# Altium schematic sheet STM32.SchDoc
size A3; SheetNumber: 3; SheetTotal: 7
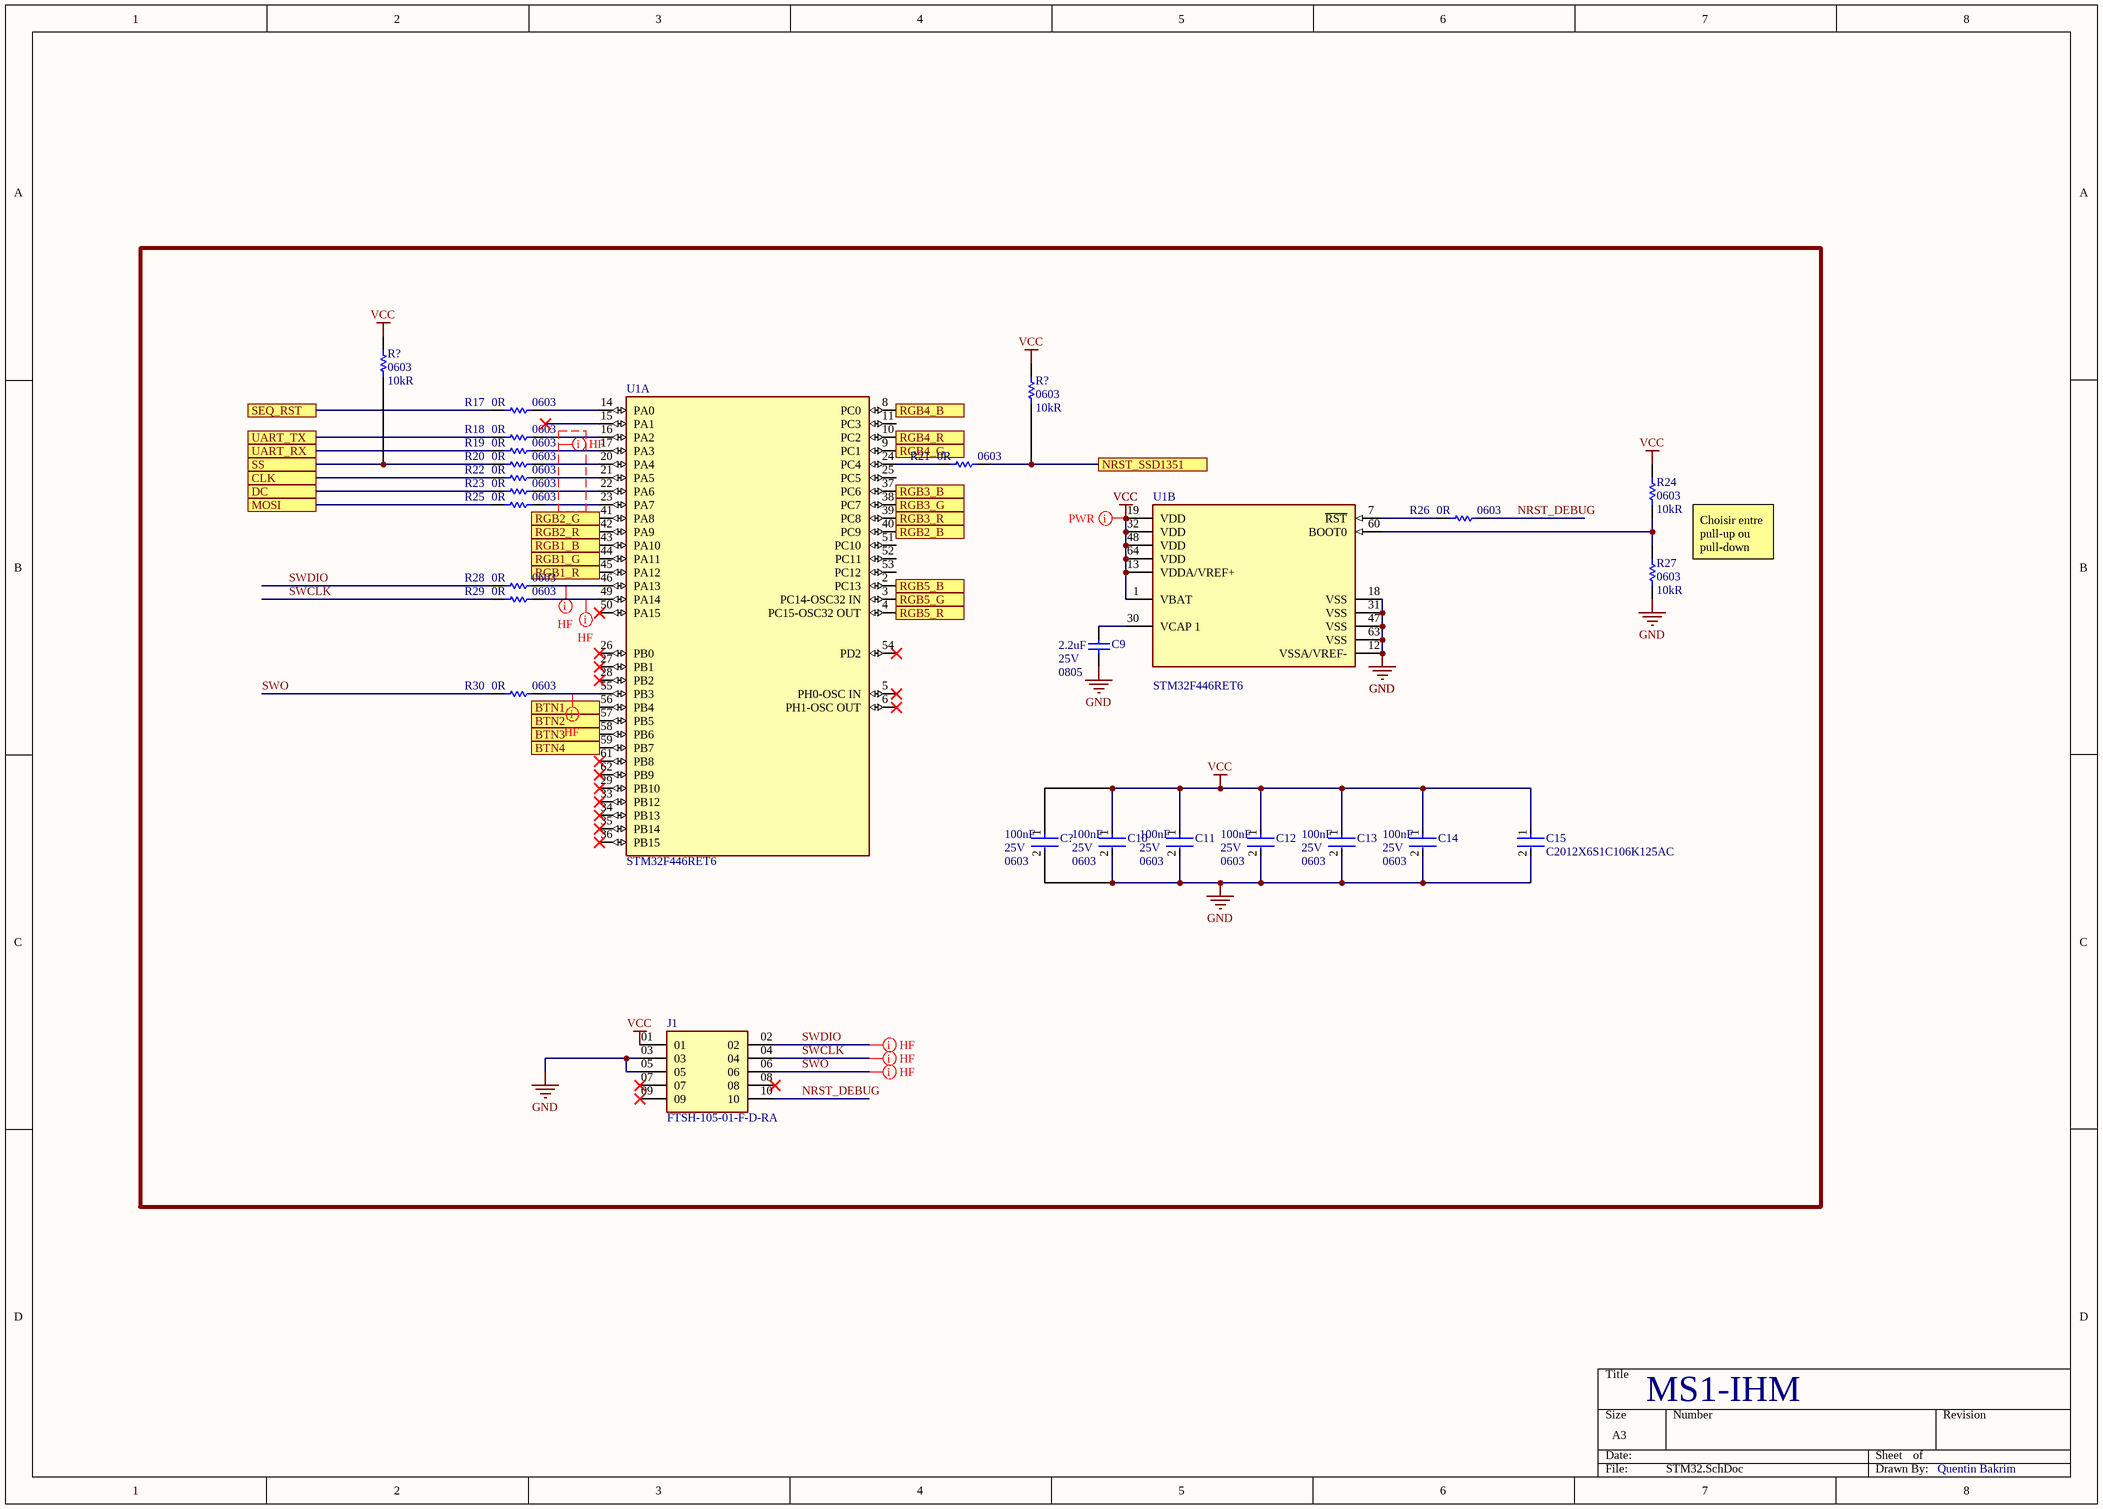
[diagram p0: STM32.SchDoc]

## Parts
(Parts that share a designator on the sheet are numbered #1, #2 ... from top to bottom, then left to right.)
C9  Case/Package: 0805  Capacitance: 2.2uF  Voltage Rating: 25V  [CAPC2013X140X45NL15T25]  (hidden comment: GRM21BR71E225KA73L)
C10  Case/Package: 0603  Voltage Rating (DC): 25V  Capacitance: 100nF  [FP-CGA3E-0_3-0_1-MFG]  (hidden comment: CGA3E2X7R1E104K080AA)
C11  Case/Package: 0603  Voltage Rating (DC): 25V  Capacitance: 100nF  [FP-CGA3E-0_3-0_1-MFG]  (hidden comment: CGA3E2X7R1E104K080AA)
C12  Case/Package: 0603  Voltage Rating (DC): 25V  Capacitance: 100nF  [FP-CGA3E-0_3-0_1-MFG]  (hidden comment: CGA3E2X7R1E104K080AA)
C13  Case/Package: 0603  Voltage Rating (DC): 25V  Capacitance: 100nF  [FP-CGA3E-0_3-0_1-MFG]  (hidden comment: CGA3E2X7R1E104K080AA)
C14  Case/Package: 0603  Voltage Rating (DC): 25V  Capacitance: 100nF  [FP-CGA3E-0_3-0_1-MFG]  (hidden comment: CGA3E2X7R1E104K080AA)
C15  C2012X6S1C106K125AC  [FP-C2012-125-0_2-MFG]
C?  Case/Package: 0603  Voltage Rating (DC): 25V  Capacitance: 100nF  [FP-CGA3E-0_3-0_1-MFG]  (hidden comment: CGA3E2X7R1E104K080AA)
J1  FTSH-105-01-F-D-RA  [SAMTEC_FTSH-105-01-F-D-RA]
R17  PackageReference: 0603  Resistor: 0R  [RESC1609X50X30NL8T20]  (hidden comment: CRCW06030000Z0EA)
R18  PackageReference: 0603  Resistor: 0R  [RESC1609X50X30NL8T20]  (hidden comment: CRCW06030000Z0EA)
R19  PackageReference: 0603  Resistor: 0R  [RESC1609X50X30NL8T20]  (hidden comment: CRCW06030000Z0EA)
R20  PackageReference: 0603  Resistor: 0R  [RESC1609X50X30NL8T20]  (hidden comment: CRCW06030000Z0EA)
R21  PackageReference: 0603  Resistor: 0R  [RESC1609X50X30NL8T20]  (hidden comment: CRCW06030000Z0EA)
R22  PackageReference: 0603  Resistor: 0R  [RESC1609X50X30NL8T20]  (hidden comment: CRCW06030000Z0EA)
R23  PackageReference: 0603  Resistor: 0R  [RESC1609X50X30NL8T20]  (hidden comment: CRCW06030000Z0EA)
R24  Case\/Package: 0603  Resistance: 10kR  [RESC1609X55X30LL15T15]  (hidden comment: ERJ3EKF1002V)
R25  PackageReference: 0603  Resistor: 0R  [RESC1609X50X30NL8T20]  (hidden comment: CRCW06030000Z0EA)
R26  PackageReference: 0603  Resistor: 0R  [RESC1609X50X30NL8T20]  (hidden comment: CRCW06030000Z0EA)
R27  Case\/Package: 0603  Resistance: 10kR  [RESC1609X55X30LL15T15]  (hidden comment: ERJ3EKF1002V)
R28  PackageReference: 0603  Resistor: 0R  [RESC1609X50X30NL8T20]  (hidden comment: CRCW06030000Z0EA)
R29  PackageReference: 0603  Resistor: 0R  [RESC1609X50X30NL8T20]  (hidden comment: CRCW06030000Z0EA)
R30  PackageReference: 0603  Resistor: 0R  [RESC1609X50X30NL8T20]  (hidden comment: CRCW06030000Z0EA)
R?#1  Case\/Package: 0603  Resistance: 10kR  [RESC1609X55X30LL15T15]  (hidden comment: ERJ3EKF1002V)
R?#2  Case\/Package: 0603  Resistance: 10kR  [RESC1609X55X30LL15T15]  (hidden comment: ERJ3EKF1002V)
U1  STM32F446RET6  [FP-LQFP64-5W-MFG]  (parts A,B of 2)

## Ports
BTN1, BTN2, BTN3, BTN4, CLK, DC, MOSI, NRST_SSD1351, RGB1_B, RGB1_G, RGB1_R, RGB2_B, RGB2_G, RGB2_R, RGB3_B, RGB3_G, RGB3_R, RGB4_B, RGB4_G, RGB4_R, RGB5_B, RGB5_G, RGB5_R, SEQ_RST, SS, UART_RX, UART_TX

## Nets
GND: C9.1 C10.2 C11.2 C12.2 C13.2 C14.2 C15.2 C?.2 J1.03 J1.05 R27.1 U1.12(VSSA/VREF-) U1.18(VSS) U1.31(VSS) U1.47(VSS) U1.63(VSS)
VCC: C10.1 C11.1 C12.1 C13.1 C14.1 C15.1 C?.1 J1.01 R24.2 R?#1.2 R?#2.2 U1.1(VBAT) U1.13(VDDA/VREF+) U1.19(VDD) U1.32(VDD) U1.48(VDD) U1.64(VDD)
BTN1: U1.56(PB4) ; port BTN1
BTN2: U1.57(PB5) ; port BTN2
BTN3: U1.58(PB6) ; port BTN3
BTN4: U1.59(PB7) ; port BTN4
CLK: R22.1 ; port CLK
DC: R23.1 ; port DC
MOSI: R25.1 ; port MOSI
NRST_DEBUG: J1.10 R26.2
NRST_SSD1351: R21.2 R?#2.1 ; port NRST_SSD1351
RGB1_B: U1.43(PA10) ; port RGB1_B
RGB1_G: U1.44(PA11) ; port RGB1_G
RGB1_R: U1.45(PA12) ; port RGB1_R
RGB2_B: U1.40(PC9) ; port RGB2_B
RGB2_G: U1.41(PA8) ; port RGB2_G
RGB2_R: U1.42(PA9) ; port RGB2_R
RGB3_B: U1.37(PC6) ; port RGB3_B
RGB3_G: U1.38(PC7) ; port RGB3_G
RGB3_R: U1.39(PC8) ; port RGB3_R
RGB4_B: U1.8(PC0) ; port RGB4_B
RGB4_G: U1.9(PC1) ; port RGB4_G
RGB4_R: U1.10(PC2) ; port RGB4_R
RGB5_B: U1.2(PC13) ; port RGB5_B
RGB5_G: U1.3(PC14-OSC32_IN) ; port RGB5_G
RGB5_R: U1.4(PC15-OSC32_OUT) ; port RGB5_R
SEQ_RST: R17.1 ; port SEQ_RST
SS: R20.1 R?#1.1 ; port SS
SWCLK: J1.04 R29.1
SWDIO: J1.02 R28.1
SWO: J1.06 R30.1
UART_RX: R19.1 ; port UART_RX
UART_TX: R18.1 ; port UART_TX
NetC9_2: C9.2 U1.30(VCAP_1)
NetR17_2: R17.2 U1.14(PA0)
NetR18_2: R18.2 U1.16(PA2)
NetR19_2: R19.2 U1.17(PA3)
NetR20_2: R20.2 U1.20(PA4)
NetR21_1: R21.1 U1.24(PC4)
NetR22_2: R22.2 U1.21(PA5)
NetR23_2: R23.2 U1.22(PA6)
NetR24_1: R24.1 R27.2 U1.60(BOOT0)
NetR25_2: R25.2 U1.23(PA7)
NetR26_1: R26.1 U1.7(~{RST})
NetR28_2: R28.2 U1.46(PA13)
NetR29_2: R29.2 U1.49(PA14)
NetR30_2: R30.2 U1.55(PB3)

Not connected (* = marked no-connect by the designer): J1 07* 08* 09*; U1 5(PH0-OSC_IN)* 6(PH1-OSC_OUT)* 11(PC3) 15(PA1)* 25(PC5) 26(PB0)* 27(PB1)* 28(PB2)* 29(PB10)* 33(PB12)* 34(PB13)* 35(PB14)* 36(PB15)* 50(PA15)* 51(PC10) 52(PC11) 53(PC12) 54(PD2)* 61(PB8)* 62(PB9)*

## Layout directives
net class HF: (no net found under the mark), NetR28_2, NetR29_2, NetR30_2, SWCLK, SWDIO, SWO
net class PWR: VCC

## Notes on the sheet
- Choisir entre pull-up ou pull-down
- MS1-IHM
- Quentin Bakrim

## Library data of the parts
C9 = CMP-2007-03405-1: Manufacturer: Murata; Material: Ceramic; Tolerance: 10%; Dielectric: X7R; Part Number: GRM21BR71E225KA73L; Supplier 1: Arrow Electronics; Supplier Part Number 1: GRM21BR71E225KA73L; Manufacturer Part Number: GRM21BR71E225KA73L; RoHS: Yes; Category: Ceramic Capacitors; Stock 1: 12000; Pricing 1: 3000=0,15000, 6000=0,14850, 9000=0,14700, 12000=0,14550, 15000=0,14400, 24000=0,14250 (USD); Mount: Surface Mount; Case Code (Metric): 2012; Case Code (Imperial): 0805; Min Operating Temperature: -55°C; Max Operating Temperature: 125°C; Package Quantity: 1; Packaging: Tape and Reel; Voltage Rating (DC): 25V; Termination: SMD/SMT; Voltage: 25V; Length: 2mm; Width: 0.049inch; Height: 1.25mm; Thickness: 0.053inch; Depth: 1.25mm; Radiation Hardening: No; REACH SVHC: No SVHC; Lead Free: Lead Free; RoHS Compliant: Yes; ComponentLink1URL: https://datasheet.ciiva.com/34302/1858990-34302875.pdf?src-supplier=Jameco; ComponentLink1Description: https://datasheet.ciiva.com/34302/1858990-34302875.pdf?src-supplier=Jameco; ComponentLink2URL: https://datasheet.ciiva.com/140/product-140527.pdf?src-supplier=Digi-Key; ComponentLink2Description: https://datasheet.ciiva.com/140/product-140527.pdf?src-supplier=Digi-Key; ComponentLink3URL: https://datasheet.ciiva.com/2989/product-2989728.pdf?src-supplier=Avnet; ComponentLink3Description: https://datasheet.ciiva.com/2989/product-2989728.pdf?src-supplier=Avnet; ComponentLink4URL: https://datasheet.ciiva.com/3776/1141grm21br71e225ka7323-3776998.pdf?src-supplier=Arrow+Electronics; ComponentLink4Description: https://datasheet.ciiva.com/3776/1141grm21br71e225ka7323-3776998.pdf?src-supplier=Arrow+Electronics; ComponentLink5URL: https://datasheet.ciiva.com/29202/450858-da-01-de-vs-chip-kond-0805-2-2-uf-10pr-25-0v-x7r-29202678.pdf?src-supplier=Conrad; ComponentLink5Description: https://datasheet.ciiva.com/29202/450858-da-01-de-vs-chip-kond-0805-2-2-uf-10pr-25-0v-x7r-29202678.pdf?src-supplier=Conrad; ComponentLink6URL: https://datasheet.ciiva.com/29199/454778-da-01-en-vs-kondensator-0805-29199535.pdf?src-supplier=Conrad; ComponentLink6Description: https://datasheet.ciiva.com/29199/454778-da-01-en-vs-kondensator-0805-29199535.pdf?src-supplier=Conrad; ComponentLink7URL: https://datasheet.ciiva.com/14116/grmseries-highdielectrictype-eng-14116411.pdf?src-supplier=Distrelec; ComponentLink7Description: https://datasheet.ciiva.com/14116/grmseries-highdielectrictype-eng-14116411.pdf?src-supplier=Distrelec; ComponentLink8URL: https://datasheet.ciiva.com/7937/415307-7937706.pdf?src-supplier=Element14; ComponentLink8Description: https://datasheet.ciiva.com/7937/415307-7937706.pdf?src-supplier=Element14; ComponentLink9URL: https://datasheet.ciiva.com/140/product-140528.pdf?src-supplier=Digi-Key; ComponentLink9Description: https://datasheet.ciiva.com/140/product-140528.pdf?src-supplier=Digi-Key; ComponentLink10URL: https://datasheet.ciiva.com/140/product-140529.pdf?src-supplier=Digi-Key; ComponentLink10Description: https://datasheet.ciiva.com/140/product-140529.pdf?src-supplier=Digi-Key; ComponentLink11URL: https://datasheet.ciiva.com/16625/product-16625259.pdf?src-supplier=Avnet+Europe; ComponentLink11Description: https://datasheet.ciiva.com/16625/product-16625259.pdf?src-supplier=Avnet+Europe; ComponentLink12URL: https://datasheet.ciiva.com/2989/product-2989727.pdf?src-supplier=Avnet; ComponentLink12Description: https://datasheet.ciiva.com/2989/product-2989727.pdf?src-supplier=Avnet
C10-C14 C? = CMP-08246-002186-1: Cap Ceramic 100nF 25V X7R 10% Pad SMD 0603 +125°C Automotive T/R; Manufacturer: TDK; Composition: Ceramic; Dielectric: X7R; Ratings: AEC-Q200; Length: 1.6mm; REACH SVHC: No SVHC; Width: 0.031inch; Packaging: Tape and Reel; Height: 0.8mm; Termination: SMD/SMT; Max Operating Temperature: 125°C; Thickness: 0.035inch; Case Code (Metric): 1608; Lead Free: Lead Free; Mount: Surface Mount; Voltage Rating: 25V; Tolerance: 10%; Weight: 7.1E-05oz; Min Operating Temperature: -55°C; Package Quantity: 1; Depth: 0.8mm; Case Code (Imperial): 0603; Supplier 1: Digi-Key; Supplier Part Number 1: 445-5667-1-ND; Manufacturer Part Number: CGA3E2X7R1E104K080AA; RoHS: Yes; Category: Ceramic Capacitors; Stock 1: 436091; Pricing 1: 1=0,10000, 10=0,05400, 50=0,02960, 100=0,02430, 500=0,01732, 1000=0,01361 (USD); Series: CGA; Resistor Type: Ceramic; RoHS Compliant: Yes; ComponentLink1URL: https://datasheet.ciiva.com/24220/cga3e2x7r1e104k080aa-265934-24220022.pdf?src-supplier=Mouser; ComponentLink1Description: https://datasheet.ciiva.com/24220/cga3e2x7r1e104k080aa-265934-24220022.pdf?src-supplier=Mouser; ComponentLink2URL: https://datasheet.ciiva.com/22725/1735392-22725638.pdf?src-supplier=Element14; ComponentLink2Description: https://datasheet.ciiva.com/22725/1735392-22725638.pdf?src-supplier=Element14; ComponentLink3URL: https://datasheet.ciiva.com/22725/1735392-22725639.pdf?src-supplier=Element14; ComponentLink3Description: https://datasheet.ciiva.com/22725/1735392-22725639.pdf?src-supplier=Element14; ComponentLink4URL: https://datasheet.ciiva.com/16427/mlccspec-automotive-general-midvoltage-en-16427320.pdf?src-supplier=Future+Electronics; ComponentLink4Description: https://datasheet.ciiva.com/16427/mlccspec-automotive-general-midvoltage-en-16427320.pdf?src-supplier=Future+Electronics; ComponentLink5URL: https://datasheet.ciiva.com/23803/1735392-23803082.pdf?src-supplier=Newark; ComponentLink5Description: https://datasheet.ciiva.com/23803/1735392-23803082.pdf?src-supplier=Newark
C15 = CMP-08246-003655-1: Multilayer Ceramic Capacitors 10μF ±10% 16V X6S SMD 0805; Capacitance: 10uF; Contact Plating: Tin; Height: 1.25mm; Thickness: 0.057inch; Case Code (Metric): 2012; Dielectric Material: Ceramic; Tolerance: 10%; Depth: 1.25mm; Length: 2mm; Lead Free: Lead Free; RoHS Compliant: Yes; Case/Package: 0805; REACH SVHC: No SVHC; Construction: Flat; Voltage Rating: 16V; Max Operating Temperature: 105°C; Series: C; Width: 0.049inch; Voltage Rating (DC): 16V; Packaging: Tape and Reel; Package Quantity: 1; Min Operating Temperature: -55°C; Mount: Surface Mount; Dielectric: X6S; Case Code (Imperial): 0805
J1 = FTSH-105-01-F-D-RA: MF: {'manufacturer': u'Samtec'}; MP: FTSH-105-01-F-D-RA; Availability: Unavailable; Price: None; Value: *; Package: None
R17-R23 R25 R26 R28-R30 = CMP-2000-03816-5: Chip Resistor, 0 Ohm, Jumper, 100 mW, -55 to 155 degC, 0603 (1608 Metric), RoHS, Tape and Reel; Manufacturer: Vishay Semiconductor; Voltage Rating: 75 V; Package Quantity: 5000; DatasheetVersion: 06/2012; Min Operating Temperature: -55 degC; ComponentLink1URL: http://www.vishay.com/; Mounting Technology: Surface Mount; Height: 0.45 mm; ComponentLink1Description: Manufacturer URL; REACH SVHC: Unknown; Packaging: Tape and Reel; Max Operating Temperature: 155 degC; Mount: Surface Mount; ComponentLink2Description: Datasheet; PackageDescription: 2-Pin Surface Mount Device, Body 1.575 x 0.85 mm; Length: 1.55 mm; ComponentLink2URL: http://www.vishay.com/docs/20035/dcrcwe3.pdf; Pins: 2; RoHSCompliant: true
R24 R27 R?#1 R?#2 = CMP-1012-00623-3: Chip Resistor, 10 KOhm, +/- 1%, 0.1 W, -55 to 155 degC, 0603 (1608 Metric), RoHS, Tape and Reel; Manufacturer: Panasonic; Voltage Rating: 75V; Power Rating: 100mW; Temperature Coefficient: 100ppm\/degreesC; Number of Pins: 2; Package Reference: 603; Depth: 0.8mm; Mount: SurfaceMount; Package Description: 2-Pin Surface Mount Device, Body 1.6 x 0.85 mm; Datasheet Version: 02/2017; Length: 1.6mm; Lead Free: LeadFree; Height: 0.45mm; Number of Terminations: 2; Max Power Dissipation: 100mW; Min Operating Temperature: -55degC; Datasheet URL: https://industrial.panasonic.com/cdbs/www-data/pdf/RDA0000/AOA0000C304.pdf; Termination: SMD/SMT; Case Code (Metric): 1608; Case Code (Imperial): 0603; Tolerance: 1%; Max Operating Temperature: 155degC; RoHSCompliant: true; Voltage Rating (DC): 75V; Radiation Hardening: No; Packaging: TapeandReel; Composition: ThickFilm; Mounting Technology: SurfaceMount; Manufacturer URL: http://www.panasonic.com/; Width: 0.031inch; REACH SVHC: NoSVHC; Contact Plating: Tin; Military Standard: Not; Package Quantity: 1
U1 = CMP-12105-000007-1: IC MCU 32BIT 512KB FLASH 64LQFP; Manufacturer: ST; Number Of Spi Channels: 4; Ram Size: 128KBytes; Standoff Height: 0.05mm; Number Of Uart Channels: 6; Number Of Pwm Channels: 32; Max Junction Temp: +105°C; Number Of I/Os: 50; Number Of Usb Channels: 2; Frequency: 180MHz; Number Of A/D Converters: 3; Max Supply Voltage: 3.6V; Number Of Adc Channels: 16; Interface: I2C,SPI,UART,USART,CAN,USB,LIN,IrDA,I2S,Other; Memory Size: 512KBytes; Number Of Timers/Counters: 14; Min Supply Voltage: 1.7V; Core Architecture: ARM Cortex-M4; Data Bus Width: 32bits; Number Of Cores: 1; Ambient Temperature Range Low: -40°C; ComponentLink2URL: https://www.st.com/en/microcontrollers-microprocessors/stm32f446re.html; Category: IC; Height: 1.6mm; Ipc Land Pattern Name: QFP50P1200X1200X160-64; Manufacturer Part Number: STM32F446RET6; Octopart: https://octopart.com/stm32f446ret6-stmicroelectronics-52642920; Temperature Range High: +105°C; Lead Free: Yes; Mouser Description: ARM Microcontrollers - MCU High-performance and DSP with FP, ARM Cortex-M4 MCU with 512 Kbytes Flash, 180 MHz CPU, Art Accelerator, SDRAM; Digikey Description: IC MCU 32BIT 512KB FLASH 64LQFP; Ambient Temperature Range High: +85°C; Number Of I2C Channels: 4; Memory Type: FLASH; RoHS: TRUE; Automotive: No; Device Class L1: Integrated Circuits (ICs); Temperature: -40°C to +105°C; Device Class L2: Embedded Processors and Controllers; Device Class L3: Microcontrollers; Temperature Range Low: -40°C; Package: LQFP64-5W; ComponentLink2Description: Datasheet